# Altium schematic sheet Power.SchDoc
size A4
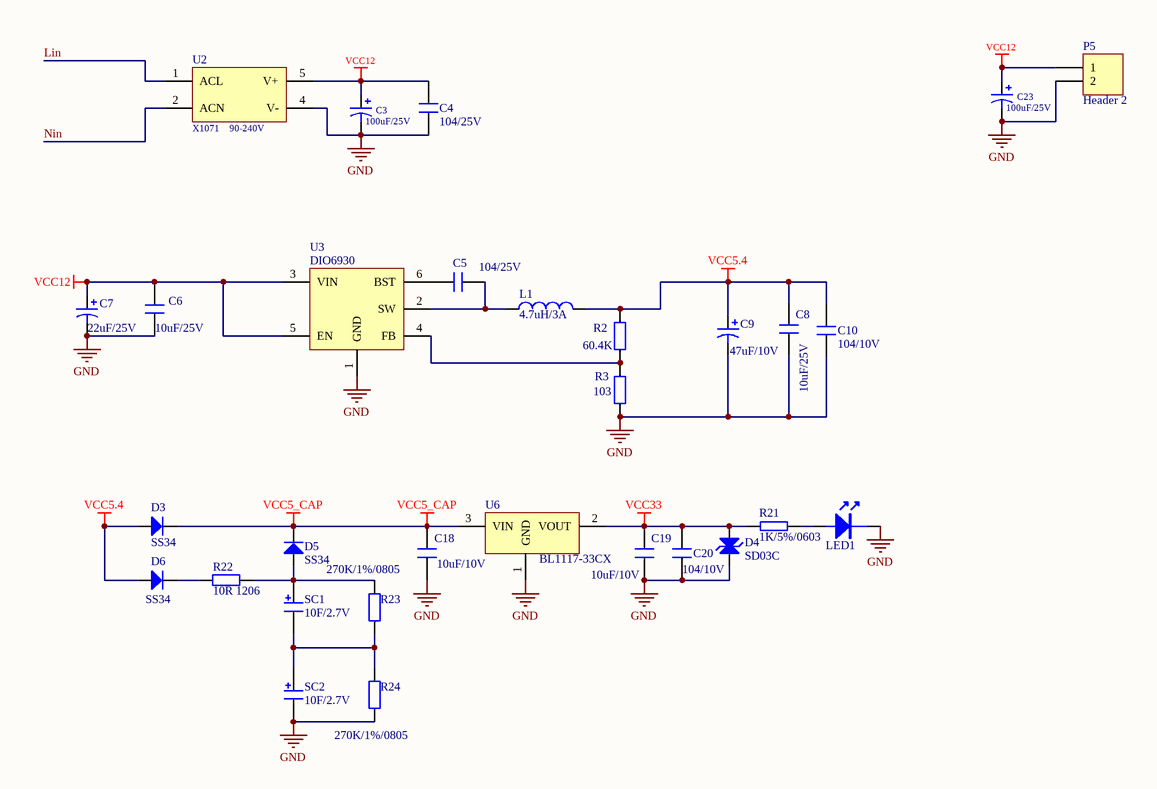
[diagram p0: Power.SchDoc]

## Parts
C3  100uF/25V  [CAPPIND06]
C4  104/25V  [0603R]
C5  104/25V  [0603R]
C6  10uF/25V  [0603R]
C7  22uF/25V  [0805R]
C8  10uF/25V  [0603R]
C9  47uF/10V  [0805R]
C10  104/10V  [0603R]
C18  10uF/10V  [0603R]
C19  10uF/10V  [0603R]
C20  104/10V  [0603R]
C23  100uF/25V  [CAPPIND06]
D3  SS34  [DO-214AC]
D4  SD03C  [SOD323]
D5  SS34  [DO-214AC]
D6  SS34  [DO-214AC]
L1  4.7uH/3A  [贴片电感5020]
LED1  LED  [0603LED]  (value not drawn)
P5  Header 2  [CONN-TH_P5.08_KF127-5.08-2P]
R2  60.4K  [0603R]
R3  103  [0603R]
R21  1K/5%/0603  [0603R]
R22  10R 1206  [1206]
R23  270K/1%/0805  [0805R]
R24  270K/1%/0805  [0805R]
SC1  10F/2.7V  [SuperCap-12.5*20 - 躺着]
SC2  10F/2.7V  [SuperCap-12.5*20 - 躺着]
U2  X1071    90-240V  [X1071]
U3  DIO6930  [SOT-23-6DBV]
U6  BL1117-33CX  [SOT-223]

## Nets
GND: C3.2 C4.1 C6.1 C7.2 C8.1 C9.2 C10.1 C18.1 C19.1 C20.1 C23.2 D4.2(A) LED1.2 P5.2 R3.2 R24.1 SC2.2 U2.4(V-) U3.1(GND) U6.1(GND)
VCC5.4: C8.2 C9.1 C10.2 D3.2(A) D6.2(A) L1.2 R2.1
VCC5_CAP: C18.2 D3.1(K) D5.1(K) U6.3(VIN)
VCC12: C3.1 C4.2 C6.2 C7.1 C23.1 P5.1 U2.5(V+) U3.3(VIN) U3.5(EN)
VCC33: C19.2 C20.2 D4.1(K) R21.1 U6.2(VOUT)
Lin: U2.1(ACL)
Nin: U2.2(ACN)
NetC5_1: C5.1 L1.1 U3.2(SW)
NetC5_2: C5.2 U3.6(BST)
NetD5_2: D5.2(A) R22.1 R23.2 SC1.1
NetD6_1: D6.1(K) R22.2
NetLED1_1: LED1.1 R21.2
NetR2_2: R2.2 R3.1 U3.4(FB)
NetR23_1: R23.1 R24.2 SC1.2 SC2.1

## Library data of the parts
C3 C7 C9 C23 = Cap Pol1: Polarized Capacitor (Radial); Published: 8-Jun-2000; LatestRevisionDate: 17-Jul-2002; LatestRevisionNote: Re-released for DXP Platform.; PackageReference: RB7.6-15; Publisher: Altium Limited; PackageDescription: Polarized Capacitor (Radial); 2 Leads
C4 C5 C10 C20 = CAP_1
C6 C8 C18 C19 = CAP
D3 D5 D6 = DIODE
D4 = TVS
L1 = Inductor: Code_IEC: 1005; Published: 8-Jun-2000; LatestRevisionDate: 29-May-2009; LatestRevisionNote: IPC-7351 Footprint Added.; PackageReference: 0402-A; Publisher: Altium Limited; PackageDescription: Chip Inductor; Code_JEITA: 0402
P5 = Header 2: Header, 2-Pin; LatestRevisionDate: 17-Jul-2002; LatestRevisionNote: Re-released for DXP Platform.; Publisher: Altium Limited
R2 R3 R22-R24 = Res2: Resistor; Published: 8-Jun-2000; LatestRevisionDate: 17-Jul-2002; LatestRevisionNote: Re-released for DXP Platform.; PackageReference: AXIAL-0.4; Publisher: Altium Limited; PackageDescription: Axial Device, Thru-Hole; 2 Leads; 0.4 in Pin Spacing
R21 = RES
SC1 SC2 = CAP+
U2 = AD2DC_EMC
U3 = BL8032
U6 = AMS1117